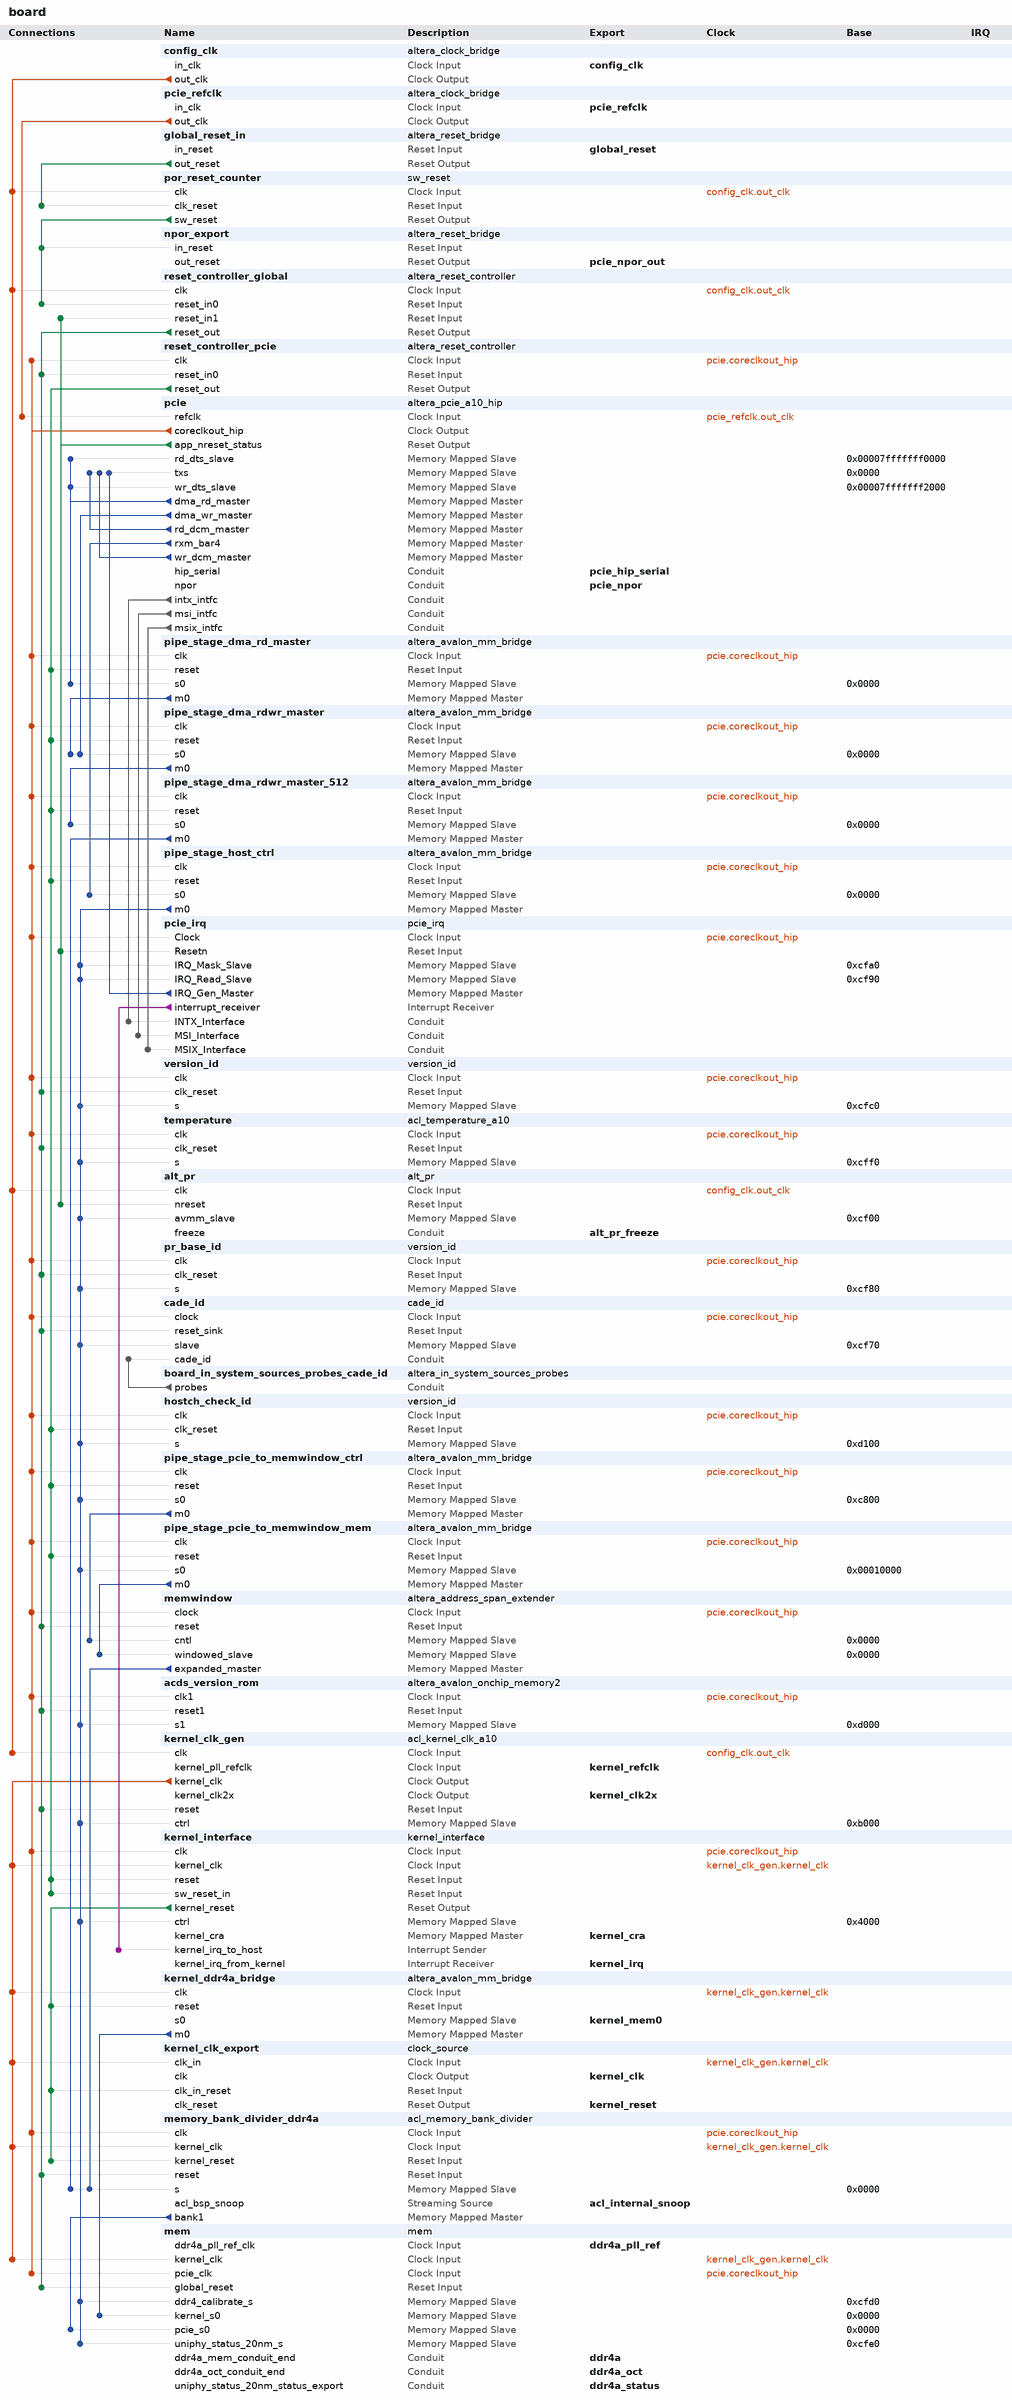
[diagram p0: system contents]
# Platform Designer (Qsys) system board, Arria 10 10AX115S2F45I1SG
# Parameters at their usual value, and those the tool derives, are not listed.
package require -exact qsys 1.0
create_system board
set_project_property DEVICE_FAMILY {Arria 10}
set_project_property DEVICE 10AX115S2F45I1SG

add_component config_clk ip/board/board_config_clk.ip altera_clock_bridge config_clk 17.1
load_component config_clk
set_component_parameter_value DERIVED_CLOCK_RATE 0
set_component_parameter_value EXPLICIT_CLOCK_RATE 50000000
save_component

add_component pcie_refclk ip/board/board_pcie_refclk.ip altera_clock_bridge pcie_refclk 17.1

add_component global_reset_in ip/board/board_global_reset_in.ip altera_reset_bridge global_reset_in 17.1
load_component global_reset_in
set_component_parameter_value ACTIVE_LOW_RESET 1
set_component_parameter_value SYNCHRONOUS_EDGES none
save_component

add_component por_reset_counter ip/board/board_por_reset_counter.ip sw_reset por_reset_counter 10.0

add_component npor_export ip/board/board_npor_export.ip altera_reset_bridge npor_export 17.1
load_component npor_export
set_component_parameter_value ACTIVE_LOW_RESET 1
set_component_parameter_value SYNCHRONOUS_EDGES none
save_component

add_component reset_controller_global ip/board/board_reset_controller_global.ip altera_reset_controller reset_controller_global 17.1

add_component reset_controller_pcie ip/board/board_reset_controller_pcie.ip altera_reset_controller reset_controller_pcie 17.1
load_component reset_controller_pcie
set_component_parameter_value NUM_RESET_INPUTS 1
set_component_parameter_value SYNC_DEPTH 2
set_component_parameter_value ADAPT_RESET_REQUEST 0
save_component

add_component pcie ip/board/board_pcie.ip altera_pcie_a10_hip pcie 17.1
load_component pcie
set_component_parameter_value interface_type_hwtcl {Avalon-MM with DMA}
set_component_parameter_value force_tag_checking_on_hwtcl 0
set_component_parameter_value app_interface_width_hwtcl 256-bit
set_component_parameter_value wrala_hwtcl 0
set_component_parameter_value base_device NIGHTFURY5
set_component_parameter_value part_trait_device 10AX115S2F45I1SG
set_component_parameter_value bar0_address_width_mux_hwtcl 9
set_component_parameter_value bar1_address_width_mux_hwtcl 0
set_component_parameter_value bar2_address_width_mux_hwtcl 0
set_component_parameter_value bar3_address_width_mux_hwtcl 0
set_component_parameter_value bar4_address_width_mux_hwtcl 18
set_component_parameter_value bar5_address_width_mux_hwtcl 0
set_component_parameter_value st_signal_width_integer_hwtcl 1
set_component_parameter_value data_width_integer_hwtcl 256
set_component_parameter_value data_width_integer_rxm_txs_hwtcl 32
set_component_parameter_value data_width_integer_txs_hwtcl 32
set_component_parameter_value data_byte_width_integer_hwtcl 32
set_component_parameter_value reconfig_address_width_integer_hwtcl 13
set_component_parameter_value data_byte_width_integer_rxm_txs_hwtcl 4
set_component_parameter_value data_byte_width_integer_txs_hwtcl 4
set_component_parameter_value burst_count_integer_hwtcl 5
set_component_parameter_value empty_integer_hwtcl 2
set_component_parameter_value port_type_integer_hwtcl 0
set_component_parameter_value link_width_integer_hwtcl 8
set_component_parameter_value lane_rate_integer_hwtcl 3
set_component_parameter_value pld_clk_mhz_integer_hwtcl 2500
set_component_parameter_value bar0_type_integer_hwtcl 1
set_component_parameter_value bar1_type_integer_hwtcl 0
set_component_parameter_value bar2_type_integer_hwtcl 0
set_component_parameter_value bar3_type_integer_hwtcl 0
set_component_parameter_value bar4_type_integer_hwtcl 1
set_component_parameter_value bar5_type_integer_hwtcl 0
set_component_parameter_value include_dma_hwtcl 1
set_component_parameter_value txs_addr_width_integer_hwtcl 64
set_component_parameter_value interface_type_integer_hwtcl 1
set_component_parameter_value dma_width_hwtcl 256
set_component_parameter_value dma_be_width_hwtcl 32
set_component_parameter_value dma_brst_cnt_w_hwtcl 5
set_component_parameter_value set_embedded_debug_enable_hwtcl 0
set_component_parameter_value set_capability_reg_enable_hwtcl 0
set_component_parameter_value set_csr_soft_logic_enable_hwtcl 0
set_component_parameter_value set_prbs_soft_logic_enable_hwtcl 0
set_component_parameter_value rcfg_jtag_enable_hwtcl 0
set_component_parameter_value cpl_spc_header_hwtcl 195
set_component_parameter_value cpl_spc_data_hwtcl 773
set_component_parameter_value avmm_addr_width_hwtcl 64
set_component_parameter_value cg_impl_cra_av_slave_port_hwtcl 0
set_component_parameter_value cg_enable_advanced_interrupt_hwtcl 1
set_component_parameter_value cg_enable_a2p_interrupt_hwtcl 0
set_component_parameter_value enable_hip_status_for_avmm_hwtcl 0
set_component_parameter_value internal_controller_hwtcl 1
set_component_parameter_value enable_rxm_burst_hwtcl 0
set_component_parameter_value extended_tag_support_hwtcl 0
set_component_parameter_value user_txs_addr_width_hwtcl 64
set_component_parameter_value cg_a2p_addr_map_num_entries_hwtcl 256
set_component_parameter_value cg_a2p_addr_map_pass_thru_bits_hwtcl 12
set_component_parameter_value link_width_hwtcl x8
set_component_parameter_value lane_rate_hwtcl {Gen3 (8.0 Gbps)}
set_component_parameter_value rx_buffer_credit_alloc_hwtcl Low
set_component_parameter_value rx_buffer_post_credit_alloc_display {Header:n/a Data:n/a}
set_component_parameter_value rx_buffer_nonpost_credit_alloc_display {Header:n/a Data:n/a}
set_component_parameter_value rx_buffer_credit_alloc_display {Header:195 Data:773}
set_component_parameter_value rx_cred_ctl_param_hwtcl 0
set_component_parameter_value set_pld_clk_x1_625MHz_hwtcl 0
set_component_parameter_value enable_avst_reset_hwtcl 0
set_component_parameter_value cseb_config_bypass_hwtcl 0
set_component_parameter_value cseb_autonomous_hwtcl 0
set_component_parameter_value speed_change_hwtcl 0
set_component_parameter_value xcvr_reconfig_hwtcl 0
set_component_parameter_value export_fpll_output_to_top_level_hwtcl 0
set_component_parameter_value export_phy_input_to_top_level_hwtcl 0
set_component_parameter_value enable_lmi_hwtcl 0
set_component_parameter_value adme_enable_hwtcl 0
set_component_parameter_value enable_devkit_conduit_hwtcl 0
set_component_parameter_value enable_skp_det 0
set_component_parameter_value dis_adapt 0
set_component_parameter_value select_design_example_hwtcl DMA
set_component_parameter_value enable_example_design_qii_hwtcl 0
set_component_parameter_value enable_example_design_sim_hwtcl 0
set_component_parameter_value enable_example_design_synth_hwtcl 0
set_component_parameter_value enable_example_design_tb_hwtcl 0
set_component_parameter_value apps_type_hwtcl 0
set_component_parameter_value select_design_example_rtl_lang_hwtcl Verilog
set_component_parameter_value targeted_devkit_hwtcl {Arria 10 GX FPGA Development Kit}
set_component_parameter_value bar0_type_hwtcl {64-bit prefetchable memory}
set_component_parameter_value bar0_address_width_hwtcl 28
set_component_parameter_value bar1_type_hwtcl Disabled
set_component_parameter_value bar1_address_width_hwtcl 0
set_component_parameter_value bar2_type_hwtcl Disabled
set_component_parameter_value bar2_address_width_hwtcl 0
set_component_parameter_value bar3_type_hwtcl Disabled
set_component_parameter_value bar3_address_width_hwtcl 0
set_component_parameter_value bar4_type_hwtcl {64-bit prefetchable memory}
set_component_parameter_value bar0_address_width_avmm_hwtcl 0
set_component_parameter_value bar1_address_width_avmm_hwtcl 0
set_component_parameter_value bar2_address_width_avmm_hwtcl 0
set_component_parameter_value bar3_address_width_avmm_hwtcl 0
set_component_parameter_value bar4_address_width_avmm_hwtcl 18
set_component_parameter_value bar5_address_width_avmm_hwtcl 0
set_component_parameter_value vendor_id_hwtcl 4466
set_component_parameter_value device_id_hwtcl 9364
set_component_parameter_value pf0_vf_device_id_hwtcl 0
set_component_parameter_value revision_id_hwtcl 1
set_component_parameter_value class_code_hwtcl 1179649
set_component_parameter_value pf0_subclass_code_hwtcl 0
set_component_parameter_value subsystem_vendor_id_hwtcl 4466
set_component_parameter_value subsystem_device_id_hwtcl 41297
set_component_parameter_value maximum_payload_size_hwtcl 256
set_component_parameter_value completion_timeout_hwtcl NONE
set_component_parameter_value enable_completion_timeout_disable_hwtcl 1
set_component_parameter_value advance_error_reporting_hwtcl 0
set_component_parameter_value ecrc_check_capable_hwtcl 0
set_component_parameter_value ecrc_gen_capable_hwtcl 0
set_component_parameter_value slot_clock_cfg_hwtcl 1
set_component_parameter_value vsec_id_hwtcl 4466
set_component_parameter_value vsec_cap_hwtcl 0
set_component_parameter_value user_id_hwtcl 0
set_component_parameter_value gen3_coeff_1_hwtcl 8
set_component_parameter_value bfm_drive_interface_clk_hwtcl 1
set_component_parameter_value bfm_drive_interface_npor_hwtcl 1
set_component_parameter_value bfm_drive_interface_pipe_hwtcl 1
set_component_parameter_value bfm_drive_interface_control_hwtcl 1
set_component_parameter_value reserved_debug_hwtcl 0
set_component_parameter_value include_sriov_hwtcl 0
set_component_parameter_value app_msi_req_fn_hwtcl 8
set_component_parameter_value cfg_num_vf_width_hwtcl 8
set_component_parameter_value flr_completed_vf_width_hwtcl 4
set_component_parameter_value sriov2_en 0
set_component_parameter_value enable_nobar_slection_hwtcl 0
set_component_parameter_value enable_custom_features_hwtcl 0
set_component_parameter_value pf0_extra_bar_present_hwtcl 0
set_component_parameter_value pf0_extra_bar_size_hwtcl 12
set_component_parameter_value devhide_support_hwtcl 0
set_component_parameter_value device_embedded_ep_support_hwtcl 0
set_component_parameter_value total_pf_count_hwtcl 1
set_component_parameter_value pf0_vf_count_user_hwtcl 0
set_component_parameter_value pf1_vf_count_user_hwtcl 0
set_component_parameter_value pf2_vf_count_user_hwtcl 0
set_component_parameter_value pf3_vf_count_user_hwtcl 0
set_component_parameter_value pf0_vf_count_hwtcl 0
set_component_parameter_value pf1_vf_count_hwtcl 0
set_component_parameter_value pf2_vf_count_hwtcl 0
set_component_parameter_value pf3_vf_count_hwtcl 0
set_component_parameter_value total_vf_count_hwtcl 4
set_component_parameter_value total_pf_count_width_hwtcl 1
set_component_parameter_value total_vf_count_width_hwtcl 1
set_component_parameter_value system_page_sizes_supported_hwtcl 1363
set_component_parameter_value sr_iov_support_hwtcl 0
set_component_parameter_value ari_support_hwtcl 0
set_component_parameter_value flr_capability_user_hwtcl 0
set_component_parameter_value flr_capability_hwtcl 0
set_component_parameter_value pf_tph_support_hwtcl 0
set_component_parameter_value pf0_tph_int_mode_support_hwtcl 0
set_component_parameter_value pf0_tph_dev_specific_mode_support_hwtcl 0
set_component_parameter_value pf0_tph_st_table_location_hwtcl 0
set_component_parameter_value pf0_tph_st_table_size_hwtcl 63
set_component_parameter_value pf1_tph_int_mode_support_hwtcl 0
set_component_parameter_value pf1_tph_dev_specific_mode_support_hwtcl 0
set_component_parameter_value pf1_tph_st_table_location_hwtcl 0
set_component_parameter_value pf1_tph_st_table_size_hwtcl 63
set_component_parameter_value pf2_tph_int_mode_support_hwtcl 0
set_component_parameter_value pf2_tph_dev_specific_mode_support_hwtcl 0
set_component_parameter_value pf2_tph_st_table_location_hwtcl 0
set_component_parameter_value pf2_tph_st_table_size_hwtcl 63
set_component_parameter_value pf3_tph_int_mode_support_hwtcl 0
set_component_parameter_value pf3_tph_dev_specific_mode_support_hwtcl 0
set_component_parameter_value pf3_tph_st_table_location_hwtcl 0
set_component_parameter_value pf3_tph_st_table_size_hwtcl 63
set_component_parameter_value vf_tph_support_hwtcl 0
set_component_parameter_value pf0_vf_tph_int_mode_support_hwtcl 0
set_component_parameter_value pf0_vf_tph_dev_specific_mode_support_hwtcl 0
set_component_parameter_value pf0_vf_tph_st_table_location_hwtcl 0
set_component_parameter_value pf0_vf_tph_st_table_size_hwtcl 63
set_component_parameter_value pf1_vf_tph_int_mode_support_hwtcl 0
set_component_parameter_value pf1_vf_tph_dev_specific_mode_support_hwtcl 0
set_component_parameter_value pf1_vf_tph_st_table_location_hwtcl 0
set_component_parameter_value pf1_vf_tph_st_table_size_hwtcl 63
set_component_parameter_value pf2_vf_tph_int_mode_support_hwtcl 0
set_component_parameter_value pf2_vf_tph_dev_specific_mode_support_hwtcl 0
set_component_parameter_value pf2_vf_tph_st_table_location_hwtcl 0
set_component_parameter_value pf2_vf_tph_st_table_size_hwtcl 63
set_component_parameter_value pf3_vf_tph_int_mode_support_hwtcl 0
set_component_parameter_value pf3_vf_tph_dev_specific_mode_support_hwtcl 0
set_component_parameter_value pf3_vf_tph_st_table_location_hwtcl 0
set_component_parameter_value pf3_vf_tph_st_table_size_hwtcl 63
set_component_parameter_value pf_ats_support_hwtcl 0
set_component_parameter_value pf0_ats_invalidate_queue_depth_hwtcl 0
set_component_parameter_value pf1_ats_invalidate_queue_depth_hwtcl 0
set_component_parameter_value pf2_ats_invalidate_queue_depth_hwtcl 0
set_component_parameter_value pf3_ats_invalidate_queue_depth_hwtcl 0
set_component_parameter_value vf_ats_support_hwtcl 0
set_component_parameter_value pf0_bar0_present_hwtcl 1
set_component_parameter_value pf0_bar1_present_hwtcl 0
set_component_parameter_value pf0_bar2_present_hwtcl 0
set_component_parameter_value pf0_bar3_present_hwtcl 0
set_component_parameter_value pf0_bar4_present_hwtcl 0
set_component_parameter_value pf0_bar5_present_hwtcl 0
set_component_parameter_value pf0_bar0_type_hwtcl 1
set_component_parameter_value pf0_bar2_type_hwtcl 1
set_component_parameter_value pf0_bar4_type_hwtcl 1
set_component_parameter_value pf0_bar0_prefetchable_hwtcl 1
set_component_parameter_value pf0_bar1_prefetchable_hwtcl 1
set_component_parameter_value pf0_bar2_prefetchable_hwtcl 1
set_component_parameter_value pf0_bar3_prefetchable_hwtcl 1
set_component_parameter_value pf0_bar4_prefetchable_hwtcl 1
set_component_parameter_value pf0_bar5_prefetchable_hwtcl 1
set_component_parameter_value pf0_bar0_size_hwtcl 12
set_component_parameter_value pf0_bar1_size_hwtcl 12
set_component_parameter_value pf0_bar2_size_hwtcl 12
set_component_parameter_value pf0_bar3_size_hwtcl 12
set_component_parameter_value pf0_bar4_size_hwtcl 12
set_component_parameter_value pf0_bar5_size_hwtcl 12
set_component_parameter_value pf0_vf_bar0_present_hwtcl 0
set_component_parameter_value pf0_vf_bar1_present_hwtcl 0
set_component_parameter_value pf0_vf_bar2_present_hwtcl 0
set_component_parameter_value pf0_vf_bar3_present_hwtcl 0
set_component_parameter_value pf0_vf_bar4_present_hwtcl 0
set_component_parameter_value pf0_vf_bar5_present_hwtcl 0
set_component_parameter_value pf0_vf_bar0_type_hwtcl 1
set_component_parameter_value pf0_vf_bar2_type_hwtcl 1
set_component_parameter_value pf0_vf_bar4_type_hwtcl 1
set_component_parameter_value pf0_vf_bar0_prefetchable_hwtcl 1
set_component_parameter_value pf0_vf_bar1_prefetchable_hwtcl 1
set_component_parameter_value pf0_vf_bar2_prefetchable_hwtcl 1
set_component_parameter_value pf0_vf_bar3_prefetchable_hwtcl 1
set_component_parameter_value pf0_vf_bar4_prefetchable_hwtcl 1
set_component_parameter_value pf0_vf_bar5_prefetchable_hwtcl 1
set_component_parameter_value pf0_vf_bar0_size_hwtcl 12
set_component_parameter_value pf0_vf_bar1_size_hwtcl 12
set_component_parameter_value pf0_vf_bar2_size_hwtcl 12
set_component_parameter_value pf0_vf_bar3_size_hwtcl 12
set_component_parameter_value pf0_vf_bar4_size_hwtcl 12
set_component_parameter_value pf0_vf_bar5_size_hwtcl 12
set_component_parameter_value pf1_bar0_present_hwtcl 0
set_component_parameter_value pf1_bar1_present_hwtcl 0
set_component_parameter_value pf1_bar2_present_hwtcl 0
set_component_parameter_value pf1_bar3_present_hwtcl 0
set_component_parameter_value pf1_bar4_present_hwtcl 0
set_component_parameter_value pf1_bar5_present_hwtcl 0
set_component_parameter_value pf1_bar0_type_hwtcl 1
set_component_parameter_value pf1_bar2_type_hwtcl 1
set_component_parameter_value pf1_bar4_type_hwtcl 1
set_component_parameter_value pf1_bar0_prefetchable_hwtcl 1
set_component_parameter_value pf1_bar1_prefetchable_hwtcl 1
set_component_parameter_value pf1_bar2_prefetchable_hwtcl 1
set_component_parameter_value pf1_bar3_prefetchable_hwtcl 1
set_component_parameter_value pf1_bar4_prefetchable_hwtcl 1
set_component_parameter_value pf1_bar5_prefetchable_hwtcl 1
set_component_parameter_value pf1_bar0_size_hwtcl 12
set_component_parameter_value pf1_bar1_size_hwtcl 12
set_component_parameter_value pf1_bar2_size_hwtcl 12
set_component_parameter_value pf1_bar3_size_hwtcl 12
set_component_parameter_value pf1_bar4_size_hwtcl 12
set_component_parameter_value pf1_bar5_size_hwtcl 12
set_component_parameter_value pf1_vf_bar0_present_hwtcl 0
set_component_parameter_value pf1_vf_bar1_present_hwtcl 0
set_component_parameter_value pf1_vf_bar2_present_hwtcl 0
set_component_parameter_value pf1_vf_bar3_present_hwtcl 0
set_component_parameter_value pf1_vf_bar4_present_hwtcl 0
set_component_parameter_value pf1_vf_bar5_present_hwtcl 0
set_component_parameter_value pf1_vf_bar0_type_hwtcl 1
set_component_parameter_value pf1_vf_bar2_type_hwtcl 1
set_component_parameter_value pf1_vf_bar4_type_hwtcl 1
set_component_parameter_value pf1_vf_bar0_prefetchable_hwtcl 1
set_component_parameter_value pf1_vf_bar1_prefetchable_hwtcl 1
set_component_parameter_value pf1_vf_bar2_prefetchable_hwtcl 1
set_component_parameter_value pf1_vf_bar3_prefetchable_hwtcl 1
set_component_parameter_value pf1_vf_bar4_prefetchable_hwtcl 1
set_component_parameter_value pf1_vf_bar5_prefetchable_hwtcl 1
set_component_parameter_value pf1_vf_bar0_size_hwtcl 12
set_component_parameter_value pf1_vf_bar1_size_hwtcl 12
set_component_parameter_value pf1_vf_bar2_size_hwtcl 12
set_component_parameter_value pf1_vf_bar3_size_hwtcl 12
set_component_parameter_value pf1_vf_bar4_size_hwtcl 12
set_component_parameter_value pf1_vf_bar5_size_hwtcl 12
set_component_parameter_value pf2_bar0_present_hwtcl 0
set_component_parameter_value pf2_bar1_present_hwtcl 0
set_component_parameter_value pf2_bar2_present_hwtcl 0
set_component_parameter_value pf2_bar3_present_hwtcl 0
set_component_parameter_value pf2_bar4_present_hwtcl 0
set_component_parameter_value pf2_bar5_present_hwtcl 0
set_component_parameter_value pf2_bar0_type_hwtcl 1
set_component_parameter_value pf2_bar2_type_hwtcl 1
set_component_parameter_value pf2_bar4_type_hwtcl 1
set_component_parameter_value pf2_bar0_prefetchable_hwtcl 1
set_component_parameter_value pf2_bar1_prefetchable_hwtcl 1
set_component_parameter_value pf2_bar2_prefetchable_hwtcl 1
set_component_parameter_value pf2_bar3_prefetchable_hwtcl 1
set_component_parameter_value pf2_bar4_prefetchable_hwtcl 1
set_component_parameter_value pf2_bar5_prefetchable_hwtcl 1
set_component_parameter_value pf2_bar0_size_hwtcl 12
set_component_parameter_value pf2_bar1_size_hwtcl 12
set_component_parameter_value pf2_bar2_size_hwtcl 12
set_component_parameter_value pf2_bar3_size_hwtcl 12
set_component_parameter_value pf2_bar4_size_hwtcl 12
set_component_parameter_value pf2_bar5_size_hwtcl 12
set_component_parameter_value pf2_vf_bar0_present_hwtcl 0
set_component_parameter_value pf2_vf_bar1_present_hwtcl 0
set_component_parameter_value pf2_vf_bar2_present_hwtcl 0
set_component_parameter_value pf2_vf_bar3_present_hwtcl 0
set_component_parameter_value pf2_vf_bar4_present_hwtcl 0
set_component_parameter_value pf2_vf_bar5_present_hwtcl 0
set_component_parameter_value pf2_vf_bar0_type_hwtcl 1
set_component_parameter_value pf2_vf_bar2_type_hwtcl 1
set_component_parameter_value pf2_vf_bar4_type_hwtcl 1
set_component_parameter_value pf2_vf_bar0_prefetchable_hwtcl 1
set_component_parameter_value pf2_vf_bar1_prefetchable_hwtcl 1
set_component_parameter_value pf2_vf_bar2_prefetchable_hwtcl 1
set_component_parameter_value pf2_vf_bar3_prefetchable_hwtcl 1
set_component_parameter_value pf2_vf_bar4_prefetchable_hwtcl 1
set_component_parameter_value pf2_vf_bar5_prefetchable_hwtcl 1
set_component_parameter_value pf2_vf_bar0_size_hwtcl 12
set_component_parameter_value pf2_vf_bar1_size_hwtcl 12
set_component_parameter_value pf2_vf_bar2_size_hwtcl 12
set_component_parameter_value pf2_vf_bar3_size_hwtcl 12
set_component_parameter_value pf2_vf_bar4_size_hwtcl 12
set_component_parameter_value pf2_vf_bar5_size_hwtcl 12
set_component_parameter_value pf3_bar0_present_hwtcl 0
set_component_parameter_value pf3_bar1_present_hwtcl 0
set_component_parameter_value pf3_bar2_present_hwtcl 0
set_component_parameter_value pf3_bar3_present_hwtcl 0
set_component_parameter_value pf3_bar4_present_hwtcl 0
set_component_parameter_value pf3_bar5_present_hwtcl 0
set_component_parameter_value pf3_bar0_type_hwtcl 1
set_component_parameter_value pf3_bar2_type_hwtcl 1
set_component_parameter_value pf3_bar4_type_hwtcl 1
set_component_parameter_value pf3_bar0_prefetchable_hwtcl 1
set_component_parameter_value pf3_bar1_prefetchable_hwtcl 1
set_component_parameter_value pf3_bar2_prefetchable_hwtcl 1
set_component_parameter_value pf3_bar3_prefetchable_hwtcl 1
set_component_parameter_value pf3_bar4_prefetchable_hwtcl 1
set_component_parameter_value pf3_bar5_prefetchable_hwtcl 1
set_component_parameter_value pf3_bar0_size_hwtcl 12
set_component_parameter_value pf3_bar1_size_hwtcl 12
set_component_parameter_value pf3_bar2_size_hwtcl 12
set_component_parameter_value pf3_bar3_size_hwtcl 12
set_component_parameter_value pf3_bar4_size_hwtcl 12
set_component_parameter_value pf3_bar5_size_hwtcl 12
set_component_parameter_value pf3_vf_bar0_present_hwtcl 0
set_component_parameter_value pf3_vf_bar1_present_hwtcl 0
set_component_parameter_value pf3_vf_bar2_present_hwtcl 0
set_component_parameter_value pf3_vf_bar3_present_hwtcl 0
set_component_parameter_value pf3_vf_bar4_present_hwtcl 0
set_component_parameter_value pf3_vf_bar5_present_hwtcl 0
set_component_parameter_value pf3_vf_bar0_type_hwtcl 1
set_component_parameter_value pf3_vf_bar2_type_hwtcl 1
set_component_parameter_value pf3_vf_bar4_type_hwtcl 1
set_component_parameter_value pf3_vf_bar0_prefetchable_hwtcl 1
set_component_parameter_value pf3_vf_bar1_prefetchable_hwtcl 1
set_component_parameter_value pf3_vf_bar2_prefetchable_hwtcl 1
set_component_parameter_value pf3_vf_bar3_prefetchable_hwtcl 1
set_component_parameter_value pf3_vf_bar4_prefetchable_hwtcl 1
set_component_parameter_value pf3_vf_bar5_prefetchable_hwtcl 1
set_component_parameter_value pf3_vf_bar0_size_hwtcl 12
set_component_parameter_value pf3_vf_bar1_size_hwtcl 12
set_component_parameter_value pf3_vf_bar2_size_hwtcl 12
set_component_parameter_value pf3_vf_bar3_size_hwtcl 12
set_component_parameter_value pf3_vf_bar4_size_hwtcl 12
set_component_parameter_value pf3_vf_bar5_size_hwtcl 12
set_component_parameter_value pf1_vendor_id_hwtcl 0
set_component_parameter_value pf1_device_id_hwtcl 0
set_component_parameter_value pf1_vf_device_id_hwtcl 0
set_component_parameter_value pf1_revision_id_hwtcl 0
set_component_parameter_value pf1_class_code_hwtcl 0
set_component_parameter_value pf1_subclass_code_hwtcl 0
set_component_parameter_value pf1_subsystem_vendor_id_hwtcl 0
set_component_parameter_value pf1_subsystem_device_id_hwtcl 0
set_component_parameter_value pf2_vendor_id_hwtcl 0
set_component_parameter_value pf2_device_id_hwtcl 0
set_component_parameter_value pf2_vf_device_id_hwtcl 0
set_component_parameter_value pf2_revision_id_hwtcl 0
set_component_parameter_value pf2_class_code_hwtcl 0
set_component_parameter_value pf2_subclass_code_hwtcl 0
set_component_parameter_value pf2_subsystem_vendor_id_hwtcl 0
set_component_parameter_value pf2_subsystem_device_id_hwtcl 0
set_component_parameter_value pf3_vendor_id_hwtcl 0
set_component_parameter_value pf3_device_id_hwtcl 0
set_component_parameter_value pf3_vf_device_id_hwtcl 0
set_component_parameter_value pf3_revision_id_hwtcl 0
set_component_parameter_value pf3_class_code_hwtcl 0
set_component_parameter_value pf3_subclass_code_hwtcl 0
set_component_parameter_value pf3_subsystem_vendor_id_hwtcl 0
set_component_parameter_value pf3_subsystem_device_id_hwtcl 0
set_component_parameter_value pf_msi_support_hwtcl 0
set_component_parameter_value pf0_msi_multi_message_capable_hwtcl 4
set_component_parameter_value pf1_msi_multi_message_capable_hwtcl 4
set_component_parameter_value pf2_msi_multi_message_capable_hwtcl 4
set_component_parameter_value pf3_msi_multi_message_capable_hwtcl 4
set_component_parameter_value pf_enable_function_msix_support_hwtcl 0
set_component_parameter_value vf_msix_cap_present_hwtcl 0
set_component_parameter_value pf0_msix_table_size_hwtcl 0
set_component_parameter_value pf0_msix_table_offset_hwtcl 0
set_component_parameter_value pf0_msix_table_bir_hwtcl 0
set_component_parameter_value pf0_msix_pba_offset_hwtcl 0
set_component_parameter_value pf0_msix_pba_bir_hwtcl 0
set_component_parameter_value pf1_msix_table_size_hwtcl 0
set_component_parameter_value pf1_msix_table_offset_hwtcl 0
set_component_parameter_value pf1_msix_table_bir_hwtcl 0
set_component_parameter_value pf1_msix_pba_offset_hwtcl 0
set_component_parameter_value pf1_msix_pba_bir_hwtcl 0
set_component_parameter_value pf2_msix_table_size_hwtcl 0
set_component_parameter_value pf2_msix_table_offset_hwtcl 0
set_component_parameter_value pf2_msix_table_bir_hwtcl 0
set_component_parameter_value pf2_msix_pba_offset_hwtcl 0
set_component_parameter_value pf2_msix_pba_bir_hwtcl 0
set_component_parameter_value pf3_msix_table_size_hwtcl 0
set_component_parameter_value pf3_msix_table_offset_hwtcl 0
set_component_parameter_value pf3_msix_table_bir_hwtcl 0
set_component_parameter_value pf3_msix_pba_offset_hwtcl 0
set_component_parameter_value pf3_msix_pba_bir_hwtcl 0
set_component_parameter_value pf0_vf_msix_tbl_size_hwtcl 0
set_component_parameter_value pf0_vf_msix_tbl_offset_hwtcl 0
set_component_parameter_value pf0_vf_msix_tbl_bir_hwtcl 0
set_component_parameter_value pf0_vf_msix_pba_offset_hwtcl 0
set_component_parameter_value pf0_vf_msix_pba_bir_hwtcl 0
set_component_parameter_value pf1_vf_msix_tbl_size_hwtcl 0
set_component_parameter_value pf1_vf_msix_tbl_offset_hwtcl 0
set_component_parameter_value pf1_vf_msix_tbl_bir_hwtcl 0
set_component_parameter_value pf1_vf_msix_pba_offset_hwtcl 0
set_component_parameter_value pf1_vf_msix_pba_bir_hwtcl 0
set_component_parameter_value pf2_vf_msix_tbl_size_hwtcl 0
set_component_parameter_value pf2_vf_msix_tbl_offset_hwtcl 0
set_component_parameter_value pf2_vf_msix_tbl_bir_hwtcl 0
set_component_parameter_value pf2_vf_msix_pba_offset_hwtcl 0
set_component_parameter_value pf2_vf_msix_pba_bir_hwtcl 0
set_component_parameter_value pf3_vf_msix_tbl_size_hwtcl 0
set_component_parameter_value pf3_vf_msix_tbl_offset_hwtcl 0
set_component_parameter_value pf3_vf_msix_tbl_bir_hwtcl 0
set_component_parameter_value pf3_vf_msix_pba_offset_hwtcl 0
set_component_parameter_value pf3_vf_msix_pba_bir_hwtcl 0
set_component_parameter_value pf0_interrupt_pin_hwtcl inta
set_component_parameter_value pf1_interrupt_pin_hwtcl inta
set_component_parameter_value pf2_interrupt_pin_hwtcl inta
set_component_parameter_value pf3_interrupt_pin_hwtcl inta
set_component_parameter_value pf0_intr_line_hwtcl 0
set_component_parameter_value pf1_intr_line_hwtcl 0
set_component_parameter_value pf2_intr_line_hwtcl 0
set_component_parameter_value pf3_intr_line_hwtcl 0
set_component_parameter_value app_msi_addr_pf_hwtcl 64
set_component_parameter_value app_msi_data_pf_hwtcl 16
set_component_parameter_value app_msi_mask_pf_hwtcl 32
set_component_parameter_value app_msi_msg_en_pf_hwtcl 3
set_component_parameter_value link2csr_width_hwtcl 16
set_component_parameter_value lmi_width_hwtcl 8
set_component_parameter_value cseb_route_to_avl_rx_st_hwtcl 0
set_component_parameter_value test_cseb_switch_hwtcl 0
set_component_parameter_value cseb_temp_busy_crs_hwtcl 0
set_component_parameter_value rx_polinv_soft_logic_enable 0
set_component_parameter_value slave_address_map_0_hwtcl 0
set_component_parameter_value slave_address_map_2_hwtcl 0
set_component_parameter_value slave_address_map_2_hprxm_hwtcl 0
set_component_parameter_value slave_address_map_4_hwtcl 18
set_component_parameter_value design_environment_hwtcl QSYS
set_component_parameter_value tlp_inspector_hwtcl 0
set_component_parameter_value tlp_inspector_use_signal_probe_hwtcl 0
set_component_parameter_value tlp_inspector_use_thin_rx_master 0
set_component_parameter_value tlp_insp_trg_dw0_hwtcl 2049
set_component_parameter_value tlp_insp_trg_dw1_hwtcl 0
set_component_parameter_value tlp_insp_trg_dw2_hwtcl 0
set_component_parameter_value enable_ast_trs_hwtcl 0
set_component_parameter_value ast_trs_num_desc_hwtcl 16
set_component_parameter_value ast_trs_txdata_width_hwtcl 256
set_component_parameter_value ast_trs_txdesc_width_hwtcl 256
set_component_parameter_value ast_trs_txstatus_width_hwtcl 256
set_component_parameter_value ast_trs_rxdata_width_hwtcl 256
set_component_parameter_value ast_trs_rxdesc_width_hwtcl 256
set_component_parameter_value ast_trs_txmty_width_hwtcl 32
set_component_parameter_value ast_trs_rxmty_width_hwtcl 32
set_component_parameter_value dma_use_scfifo_ext_hwtcl 0
set_component_parameter_value use_dynamic_design_example_hwtcl 0
set_component_parameter_value use_rpbfm_pro 0
set_component_parameter_value silicon_rev 20nm5es
set_component_parameter_value hip_ac_pwr_clk_freq_in_hz 250000000
set_component_parameter_value ko_compl_data 773
set_component_parameter_value ko_compl_header 195
set_component_parameter_value acknack_base 0
set_component_parameter_value acknack_set false
set_component_parameter_value advance_error_reporting disable
set_component_parameter_value app_interface_width avst_256bit
set_component_parameter_value arb_upfc_30us_counter 0
set_component_parameter_value arb_upfc_30us_en enable
set_component_parameter_value aspm_config_management true
set_component_parameter_value aspm_patch_disable enable_both
set_component_parameter_value ast_width_rx rx_256
set_component_parameter_value ast_width_tx tx_256
set_component_parameter_value atomic_malformed false
set_component_parameter_value atomic_op_completer_32bit false
set_component_parameter_value atomic_op_completer_64bit false
set_component_parameter_value atomic_op_routing false
set_component_parameter_value auto_msg_drop_enable false
set_component_parameter_value bar0_size_mask 0
set_component_parameter_value bar0_type bar0_64bit_prefetch_mem
set_component_parameter_value bar1_size_mask 0
set_component_parameter_value bar1_type bar1_disable
set_component_parameter_value bar2_size_mask 0
set_component_parameter_value bar2_type bar2_disable
set_component_parameter_value bar3_size_mask 0
set_component_parameter_value bar3_type bar3_disable
set_component_parameter_value bar4_size_mask 0
set_component_parameter_value bar4_type bar4_64bit_prefetch_mem
set_component_parameter_value bar5_size_mask 0
set_component_parameter_value bar5_type bar5_disable
set_component_parameter_value base_counter_sel count_clk_62p5
set_component_parameter_value bist_memory_settings 2417851639246850506078208
set_component_parameter_value bridge_port_ssid_support false
set_component_parameter_value bridge_port_vga_enable false
set_component_parameter_value bypass_cdc false
set_component_parameter_value bypass_clk_switch false
set_component_parameter_value bypass_tl false
set_component_parameter_value cas_completer_128bit false
set_component_parameter_value cdc_clk_relation plesiochronous
set_component_parameter_value cdc_dummy_insert_limit 11
set_component_parameter_value cfg_parchk_ena disable
set_component_parameter_value cfgbp_req_recov_disable false
set_component_parameter_value class_code 1179649
set_component_parameter_value clock_pwr_management false
set_component_parameter_value completion_timeout none_compl_timeout
set_component_parameter_value core_clk_divider div_2
set_component_parameter_value core_clk_freq_mhz core_clk_250mhz
set_component_parameter_value core_clk_out_sel core_clk_out_div_1
set_component_parameter_value core_clk_sel pld_clk
set_component_parameter_value core_clk_source pll_fixed_clk
set_component_parameter_value cseb_bar_match_checking enable
set_component_parameter_value cseb_config_bypass disable
set_component_parameter_value cseb_cpl_status_during_cvp config_retry_status
set_component_parameter_value cseb_cpl_tag_checking enable
set_component_parameter_value cseb_disable_auto_crs false
set_component_parameter_value cseb_extend_pci false
set_component_parameter_value cseb_extend_pcie false
set_component_parameter_value cseb_min_error_checking false
set_component_parameter_value cseb_route_to_avl_rx_st cseb
set_component_parameter_value cseb_temp_busy_crs completer_abort_tmp_busy
set_component_parameter_value cvp_clk_reset false
set_component_parameter_value cvp_data_compressed false
set_component_parameter_value cvp_data_encrypted false
set_component_parameter_value cvp_enable cvp_dis
set_component_parameter_value cvp_mode_reset false
set_component_parameter_value cvp_rate_sel full_rate
set_component_parameter_value d0_pme false
set_component_parameter_value d1_pme false
set_component_parameter_value d1_support false
set_component_parameter_value d2_pme false
set_component_parameter_value d2_support false
set_component_parameter_value d3_cold_pme false
set_component_parameter_value d3_hot_pme false
set_component_parameter_value data_pack_rx disable
set_component_parameter_value deemphasis_enable false
set_component_parameter_value deskew_comma skp_eieos_deskw
set_component_parameter_value device_id 9364
set_component_parameter_value device_number 0
set_component_parameter_value device_specific_init false
set_component_parameter_value dft_clock_obsrv_en disable
set_component_parameter_value dft_clock_obsrv_sel dft_pclk
set_component_parameter_value diffclock_nfts_count 128
set_component_parameter_value dis_cplovf disable
set_component_parameter_value dis_paritychk disable
set_component_parameter_value disable_link_x2_support false
set_component_parameter_value disable_snoop_packet false
set_component_parameter_value dl_tx_check_parity_edb disable
set_component_parameter_value dll_active_report_support false
set_component_parameter_value early_dl_up false
set_component_parameter_value ecrc_check_capable false
set_component_parameter_value ecrc_gen_capable false
set_component_parameter_value egress_block_err_report_ena false
set_component_parameter_value ei_delay_powerdown_count 10
set_component_parameter_value eie_before_nfts_count 4
set_component_parameter_value electromech_interlock false
set_component_parameter_value en_ieiupdatefc false
set_component_parameter_value en_lane_errchk false
set_component_parameter_value en_phystatus_dly false
set_component_parameter_value ena_ido_cpl false
set_component_parameter_value ena_ido_req false
set_component_parameter_value enable_adapter_half_rate_mode false
set_component_parameter_value enable_ch0_pclk_out pclk_central
set_component_parameter_value enable_ch01_pclk_out pclk_ch0
set_component_parameter_value enable_completion_timeout_disable true
set_component_parameter_value enable_directed_spd_chng false
set_component_parameter_value enable_function_msix_support false
set_component_parameter_value enable_l0s_aspm false
set_component_parameter_value enable_l1_aspm false
set_component_parameter_value enable_rx_buffer_checking false
set_component_parameter_value enable_rx_reordering true
set_component_parameter_value enable_slot_register false
set_component_parameter_value endpoint_l0_latency 0
set_component_parameter_value endpoint_l1_latency 0
set_component_parameter_value eql_rq_int_en_number 0
set_component_parameter_value errmgt_fcpe_patch_dis enable
set_component_parameter_value errmgt_fep_patch_dis enable
set_component_parameter_value expansion_base_address_register 0
set_component_parameter_value extend_tag_field false
set_component_parameter_value extended_format_field true
set_component_parameter_value extended_tag_reset false
set_component_parameter_value fc_init_timer 1024
set_component_parameter_value flow_control_timeout_count 200
set_component_parameter_value flow_control_update_count 30
set_component_parameter_value flr_capability false
set_component_parameter_value force_dis_to_det false
set_component_parameter_value force_gen1_dis false
set_component_parameter_value force_tx_coeff_preset_lpbk false
set_component_parameter_value frame_err_patch_dis enable
set_component_parameter_value func_mode enable
set_component_parameter_value g3_bypass_equlz false
set_component_parameter_value g3_coeff_done_tmout enable
set_component_parameter_value g3_deskew_char default_sdsos
set_component_parameter_value g3_dis_be_frm_err false
set_component_parameter_value g3_dn_rx_hint_eqlz_0 0
set_component_parameter_value g3_dn_rx_hint_eqlz_1 0
set_component_parameter_value g3_dn_rx_hint_eqlz_2 0
set_component_parameter_value g3_dn_rx_hint_eqlz_3 0
set_component_parameter_value g3_dn_rx_hint_eqlz_4 0
set_component_parameter_value g3_dn_rx_hint_eqlz_5 0
set_component_parameter_value g3_dn_rx_hint_eqlz_6 0
set_component_parameter_value g3_dn_rx_hint_eqlz_7 0
set_component_parameter_value g3_dn_tx_preset_eqlz_0 0
set_component_parameter_value g3_dn_tx_preset_eqlz_1 0
set_component_parameter_value g3_dn_tx_preset_eqlz_2 0
set_component_parameter_value g3_dn_tx_preset_eqlz_3 0
set_component_parameter_value g3_dn_tx_preset_eqlz_4 0
set_component_parameter_value g3_dn_tx_preset_eqlz_5 0
set_component_parameter_value g3_dn_tx_preset_eqlz_6 0
set_component_parameter_value g3_dn_tx_preset_eqlz_7 0
set_component_parameter_value g3_force_ber_max false
set_component_parameter_value g3_force_ber_min true
set_component_parameter_value g3_lnk_trn_rx_ts false
set_component_parameter_value g3_ltssm_eq_dbg false
set_component_parameter_value g3_ltssm_rec_dbg true
set_component_parameter_value g3_pause_ltssm_rec_en disable
set_component_parameter_value g3_quiesce_guarant false
set_component_parameter_value g3_redo_equlz_dis false
set_component_parameter_value g3_redo_equlz_en false
set_component_parameter_value g3_up_rx_hint_eqlz_0 0
set_component_parameter_value g3_up_rx_hint_eqlz_1 0
set_component_parameter_value g3_up_rx_hint_eqlz_2 0
set_component_parameter_value g3_up_rx_hint_eqlz_3 0
set_component_parameter_value g3_up_rx_hint_eqlz_4 0
set_component_parameter_value g3_up_rx_hint_eqlz_5 0
set_component_parameter_value g3_up_rx_hint_eqlz_6 0
set_component_parameter_value g3_up_rx_hint_eqlz_7 0
set_component_parameter_value g3_up_tx_preset_eqlz_0 0
set_component_parameter_value g3_up_tx_preset_eqlz_1 0
set_component_parameter_value g3_up_tx_preset_eqlz_2 0
set_component_parameter_value g3_up_tx_preset_eqlz_3 0
set_component_parameter_value g3_up_tx_preset_eqlz_4 0
set_component_parameter_value g3_up_tx_preset_eqlz_5 0
set_component_parameter_value g3_up_tx_preset_eqlz_6 0
set_component_parameter_value g3_up_tx_preset_eqlz_7 0
set_component_parameter_value gen123_lane_rate_mode gen1_gen2_gen3
set_component_parameter_value gen2_diffclock_nfts_count 255
set_component_parameter_value gen2_pma_pll_usage not_applicaple
set_component_parameter_value gen2_sameclock_nfts_count 255
set_component_parameter_value gen3_coeff_1 8
set_component_parameter_value gen3_coeff_1_ber_meas 4
set_component_parameter_value gen3_coeff_1_nxtber_less 1
set_component_parameter_value gen3_coeff_1_nxtber_more 1
set_component_parameter_value gen3_coeff_1_preset_hint 0
set_component_parameter_value gen3_coeff_1_reqber 0
set_component_parameter_value gen3_coeff_1_sel preset_1
set_component_parameter_value gen3_coeff_10 0
set_component_parameter_value gen3_coeff_10_ber_meas 0
set_component_parameter_value gen3_coeff_10_nxtber_less 0
set_component_parameter_value gen3_coeff_10_nxtber_more 0
set_component_parameter_value gen3_coeff_10_preset_hint 0
set_component_parameter_value gen3_coeff_10_reqber 0
set_component_parameter_value gen3_coeff_10_sel preset_10
set_component_parameter_value gen3_coeff_11 0
set_component_parameter_value gen3_coeff_11_ber_meas 0
set_component_parameter_value gen3_coeff_11_nxtber_less 0
set_component_parameter_value gen3_coeff_11_nxtber_more 0
set_component_parameter_value gen3_coeff_11_preset_hint 0
set_component_parameter_value gen3_coeff_11_reqber 0
set_component_parameter_value gen3_coeff_11_sel preset_11
set_component_parameter_value gen3_coeff_12 0
set_component_parameter_value gen3_coeff_12_ber_meas 0
set_component_parameter_value gen3_coeff_12_nxtber_less 0
set_component_parameter_value gen3_coeff_12_nxtber_more 0
set_component_parameter_value gen3_coeff_12_preset_hint 0
set_component_parameter_value gen3_coeff_12_reqber 0
set_component_parameter_value gen3_coeff_12_sel preset_12
set_component_parameter_value gen3_coeff_13 0
set_component_parameter_value gen3_coeff_13_ber_meas 0
set_component_parameter_value gen3_coeff_13_nxtber_less 0
set_component_parameter_value gen3_coeff_13_nxtber_more 0
set_component_parameter_value gen3_coeff_13_preset_hint 0
set_component_parameter_value gen3_coeff_13_reqber 0
set_component_parameter_value gen3_coeff_13_sel preset_13
set_component_parameter_value gen3_coeff_14 0
set_component_parameter_value gen3_coeff_14_ber_meas 0
set_component_parameter_value gen3_coeff_14_nxtber_less 0
set_component_parameter_value gen3_coeff_14_nxtber_more 0
set_component_parameter_value gen3_coeff_14_preset_hint 0
set_component_parameter_value gen3_coeff_14_reqber 0
set_component_parameter_value gen3_coeff_14_sel preset_14
set_component_parameter_value gen3_coeff_15 0
set_component_parameter_value gen3_coeff_15_ber_meas 0
set_component_parameter_value gen3_coeff_15_nxtber_less 0
set_component_parameter_value gen3_coeff_15_nxtber_more 0
set_component_parameter_value gen3_coeff_15_preset_hint 0
set_component_parameter_value gen3_coeff_15_reqber 0
set_component_parameter_value gen3_coeff_15_sel preset_15
set_component_parameter_value gen3_coeff_16 0
set_component_parameter_value gen3_coeff_16_ber_meas 0
set_component_parameter_value gen3_coeff_16_nxtber_less 0
set_component_parameter_value gen3_coeff_16_nxtber_more 0
set_component_parameter_value gen3_coeff_16_preset_hint 0
set_component_parameter_value gen3_coeff_16_reqber 0
set_component_parameter_value gen3_coeff_16_sel preset_16
set_component_parameter_value gen3_coeff_17 196608
set_component_parameter_value gen3_coeff_17_ber_meas 0
set_component_parameter_value gen3_coeff_17_nxtber_less 0
set_component_parameter_value gen3_coeff_17_nxtber_more 0
set_component_parameter_value gen3_coeff_17_preset_hint 0
set_component_parameter_value gen3_coeff_17_reqber 0
set_component_parameter_value gen3_coeff_17_sel preset_17
set_component_parameter_value gen3_coeff_18 196609
set_component_parameter_value gen3_coeff_18_ber_meas 0
set_component_parameter_value gen3_coeff_18_nxtber_less 0
set_component_parameter_value gen3_coeff_18_nxtber_more 0
set_component_parameter_value gen3_coeff_18_preset_hint 0
set_component_parameter_value gen3_coeff_18_reqber 0
set_component_parameter_value gen3_coeff_18_sel preset_18
set_component_parameter_value gen3_coeff_19 196609
set_component_parameter_value gen3_coeff_19_ber_meas 0
set_component_parameter_value gen3_coeff_19_nxtber_less 0
set_component_parameter_value gen3_coeff_19_nxtber_more 0
set_component_parameter_value gen3_coeff_19_preset_hint 0
set_component_parameter_value gen3_coeff_19_reqber 0
set_component_parameter_value gen3_coeff_19_sel preset_19
set_component_parameter_value gen3_coeff_2 8
set_component_parameter_value gen3_coeff_2_ber_meas 4
set_component_parameter_value gen3_coeff_2_nxtber_less 2
set_component_parameter_value gen3_coeff_2_nxtber_more 2
set_component_parameter_value gen3_coeff_2_preset_hint 7
set_component_parameter_value gen3_coeff_2_reqber 0
set_component_parameter_value gen3_coeff_2_sel preset_2
set_component_parameter_value gen3_coeff_20 196609
set_component_parameter_value gen3_coeff_20_ber_meas 0
set_component_parameter_value gen3_coeff_20_nxtber_less 0
set_component_parameter_value gen3_coeff_20_nxtber_more 0
set_component_parameter_value gen3_coeff_20_preset_hint 0
set_component_parameter_value gen3_coeff_20_reqber 0
set_component_parameter_value gen3_coeff_20_sel preset_20
set_component_parameter_value gen3_coeff_21 196609
set_component_parameter_value gen3_coeff_21_ber_meas 0
set_component_parameter_value gen3_coeff_21_nxtber_less 0
set_component_parameter_value gen3_coeff_21_nxtber_more 0
set_component_parameter_value gen3_coeff_21_preset_hint 0
set_component_parameter_value gen3_coeff_21_reqber 0
set_component_parameter_value gen3_coeff_21_sel preset_21
set_component_parameter_value gen3_coeff_22 196609
set_component_parameter_value gen3_coeff_22_ber_meas 0
set_component_parameter_value gen3_coeff_22_nxtber_less 7
set_component_parameter_value gen3_coeff_22_nxtber_more 0
set_component_parameter_value gen3_coeff_22_preset_hint 0
set_component_parameter_value gen3_coeff_22_reqber 0
set_component_parameter_value gen3_coeff_22_sel preset_22
set_component_parameter_value gen3_coeff_23 196609
set_component_parameter_value gen3_coeff_23_ber_meas 0
set_component_parameter_value gen3_coeff_23_nxtber_less 0
set_component_parameter_value gen3_coeff_23_nxtber_more 0
set_component_parameter_value gen3_coeff_23_preset_hint 0
set_component_parameter_value gen3_coeff_23_reqber 0
set_component_parameter_value gen3_coeff_23_sel preset_23
set_component_parameter_value gen3_coeff_24 196609
set_component_parameter_value gen3_coeff_24_ber_meas 0
set_component_parameter_value gen3_coeff_24_nxtber_less 0
set_component_parameter_value gen3_coeff_24_nxtber_more 0
set_component_parameter_value gen3_coeff_24_preset_hint 7
set_component_parameter_value gen3_coeff_24_reqber 0
set_component_parameter_value gen3_coeff_24_sel preset_24
set_component_parameter_value gen3_coeff_3 8
set_component_parameter_value gen3_coeff_3_ber_meas 8
set_component_parameter_value gen3_coeff_3_nxtber_less 4
set_component_parameter_value gen3_coeff_3_nxtber_more 4
set_component_parameter_value gen3_coeff_3_preset_hint 7
set_component_parameter_value gen3_coeff_3_reqber 31
set_component_parameter_value gen3_coeff_3_sel preset_3
set_component_parameter_value gen3_coeff_4 8
set_component_parameter_value gen3_coeff_4_ber_meas 4
set_component_parameter_value gen3_coeff_4_nxtber_less 4
set_component_parameter_value gen3_coeff_4_nxtber_more 4
set_component_parameter_value gen3_coeff_4_preset_hint 7
set_component_parameter_value gen3_coeff_4_reqber 31
set_component_parameter_value gen3_coeff_4_sel preset_4
set_component_parameter_value gen3_coeff_5 0
set_component_parameter_value gen3_coeff_5_ber_meas 0
set_component_parameter_value gen3_coeff_5_nxtber_less 0
set_component_parameter_value gen3_coeff_5_nxtber_more 0
set_component_parameter_value gen3_coeff_5_preset_hint 7
set_component_parameter_value gen3_coeff_5_reqber 0
set_component_parameter_value gen3_coeff_5_sel preset_5
set_component_parameter_value gen3_coeff_6 0
set_component_parameter_value gen3_coeff_6_ber_meas 0
set_component_parameter_value gen3_coeff_6_nxtber_less 0
set_component_parameter_value gen3_coeff_6_nxtber_more 0
set_component_parameter_value gen3_coeff_6_preset_hint 0
set_component_parameter_value gen3_coeff_6_reqber 0
set_component_parameter_value gen3_coeff_6_sel preset_6
set_component_parameter_value gen3_coeff_7 0
set_component_parameter_value gen3_coeff_7_ber_meas 0
set_component_parameter_value gen3_coeff_7_nxtber_less 0
set_component_parameter_value gen3_coeff_7_nxtber_more 0
set_component_parameter_value gen3_coeff_7_preset_hint 0
set_component_parameter_value gen3_coeff_7_reqber 0
set_component_parameter_value gen3_coeff_7_sel preset_7
set_component_parameter_value gen3_coeff_8 0
set_component_parameter_value gen3_coeff_8_ber_meas 0
set_component_parameter_value gen3_coeff_8_nxtber_less 0
set_component_parameter_value gen3_coeff_8_nxtber_more 0
set_component_parameter_value gen3_coeff_8_preset_hint 0
set_component_parameter_value gen3_coeff_8_reqber 0
set_component_parameter_value gen3_coeff_8_sel preset_8
set_component_parameter_value gen3_coeff_9 0
set_component_parameter_value gen3_coeff_9_ber_meas 0
set_component_parameter_value gen3_coeff_9_nxtber_less 0
set_component_parameter_value gen3_coeff_9_nxtber_more 0
set_component_parameter_value gen3_coeff_9_preset_hint 0
set_component_parameter_value gen3_coeff_9_reqber 0
set_component_parameter_value gen3_coeff_9_sel preset_9
set_component_parameter_value gen3_coeff_delay_count 125
set_component_parameter_value gen3_coeff_errchk enable
set_component_parameter_value gen3_dcbal_en true
set_component_parameter_value gen3_diffclock_nfts_count 128
set_component_parameter_value gen3_force_local_coeff false
set_component_parameter_value gen3_full_swing 60
set_component_parameter_value gen3_half_swing false
set_component_parameter_value gen3_low_freq 20
set_component_parameter_value gen3_paritychk enable
set_component_parameter_value gen3_pl_framing_err_dis enable
set_component_parameter_value gen3_preset_coeff_1 64320
set_component_parameter_value gen3_preset_coeff_10 3210
set_component_parameter_value gen3_preset_coeff_11 84480
set_component_parameter_value gen3_preset_coeff_2 44160
set_component_parameter_value gen3_preset_coeff_3 52224
set_component_parameter_value gen3_preset_coeff_4 36096
set_component_parameter_value gen3_preset_coeff_5 3840
set_component_parameter_value gen3_preset_coeff_6 3462
set_component_parameter_value gen3_preset_coeff_7 3336
set_component_parameter_value gen3_preset_coeff_8 51846
set_component_parameter_value gen3_preset_coeff_9 35592
